# Altium schematic sheet SFarm.SchDoc
size A3; Organization: Altium Limited; Address1: L3, 12a Rodborough Rd; Address2: Frenchs Forest; Address3: NSW; Address4: Australia 2086
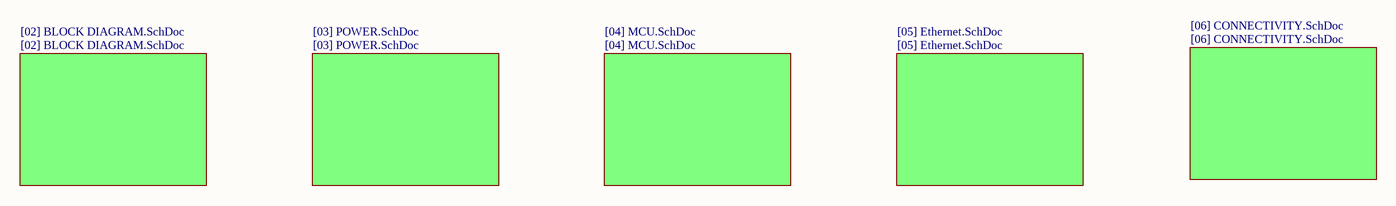
[diagram p0: SFarm.SchDoc]

## Sub-sheets
[02] BLOCK DIAGRAM.SchDoc = [02] BLOCK DIAGRAM.SchDoc: no entries
[03] POWER.SchDoc = [03] POWER.SchDoc: no entries
[04] MCU.SchDoc = [04] MCU.SchDoc: no entries
[05] Ethernet.SchDoc = [05] Ethernet.SchDoc: no entries
[06] CONNECTIVITY.SchDoc = [06] CONNECTIVITY.SchDoc: no entries